# EAGLE design Un_TTL_2 (EAGLE 7.5.0)
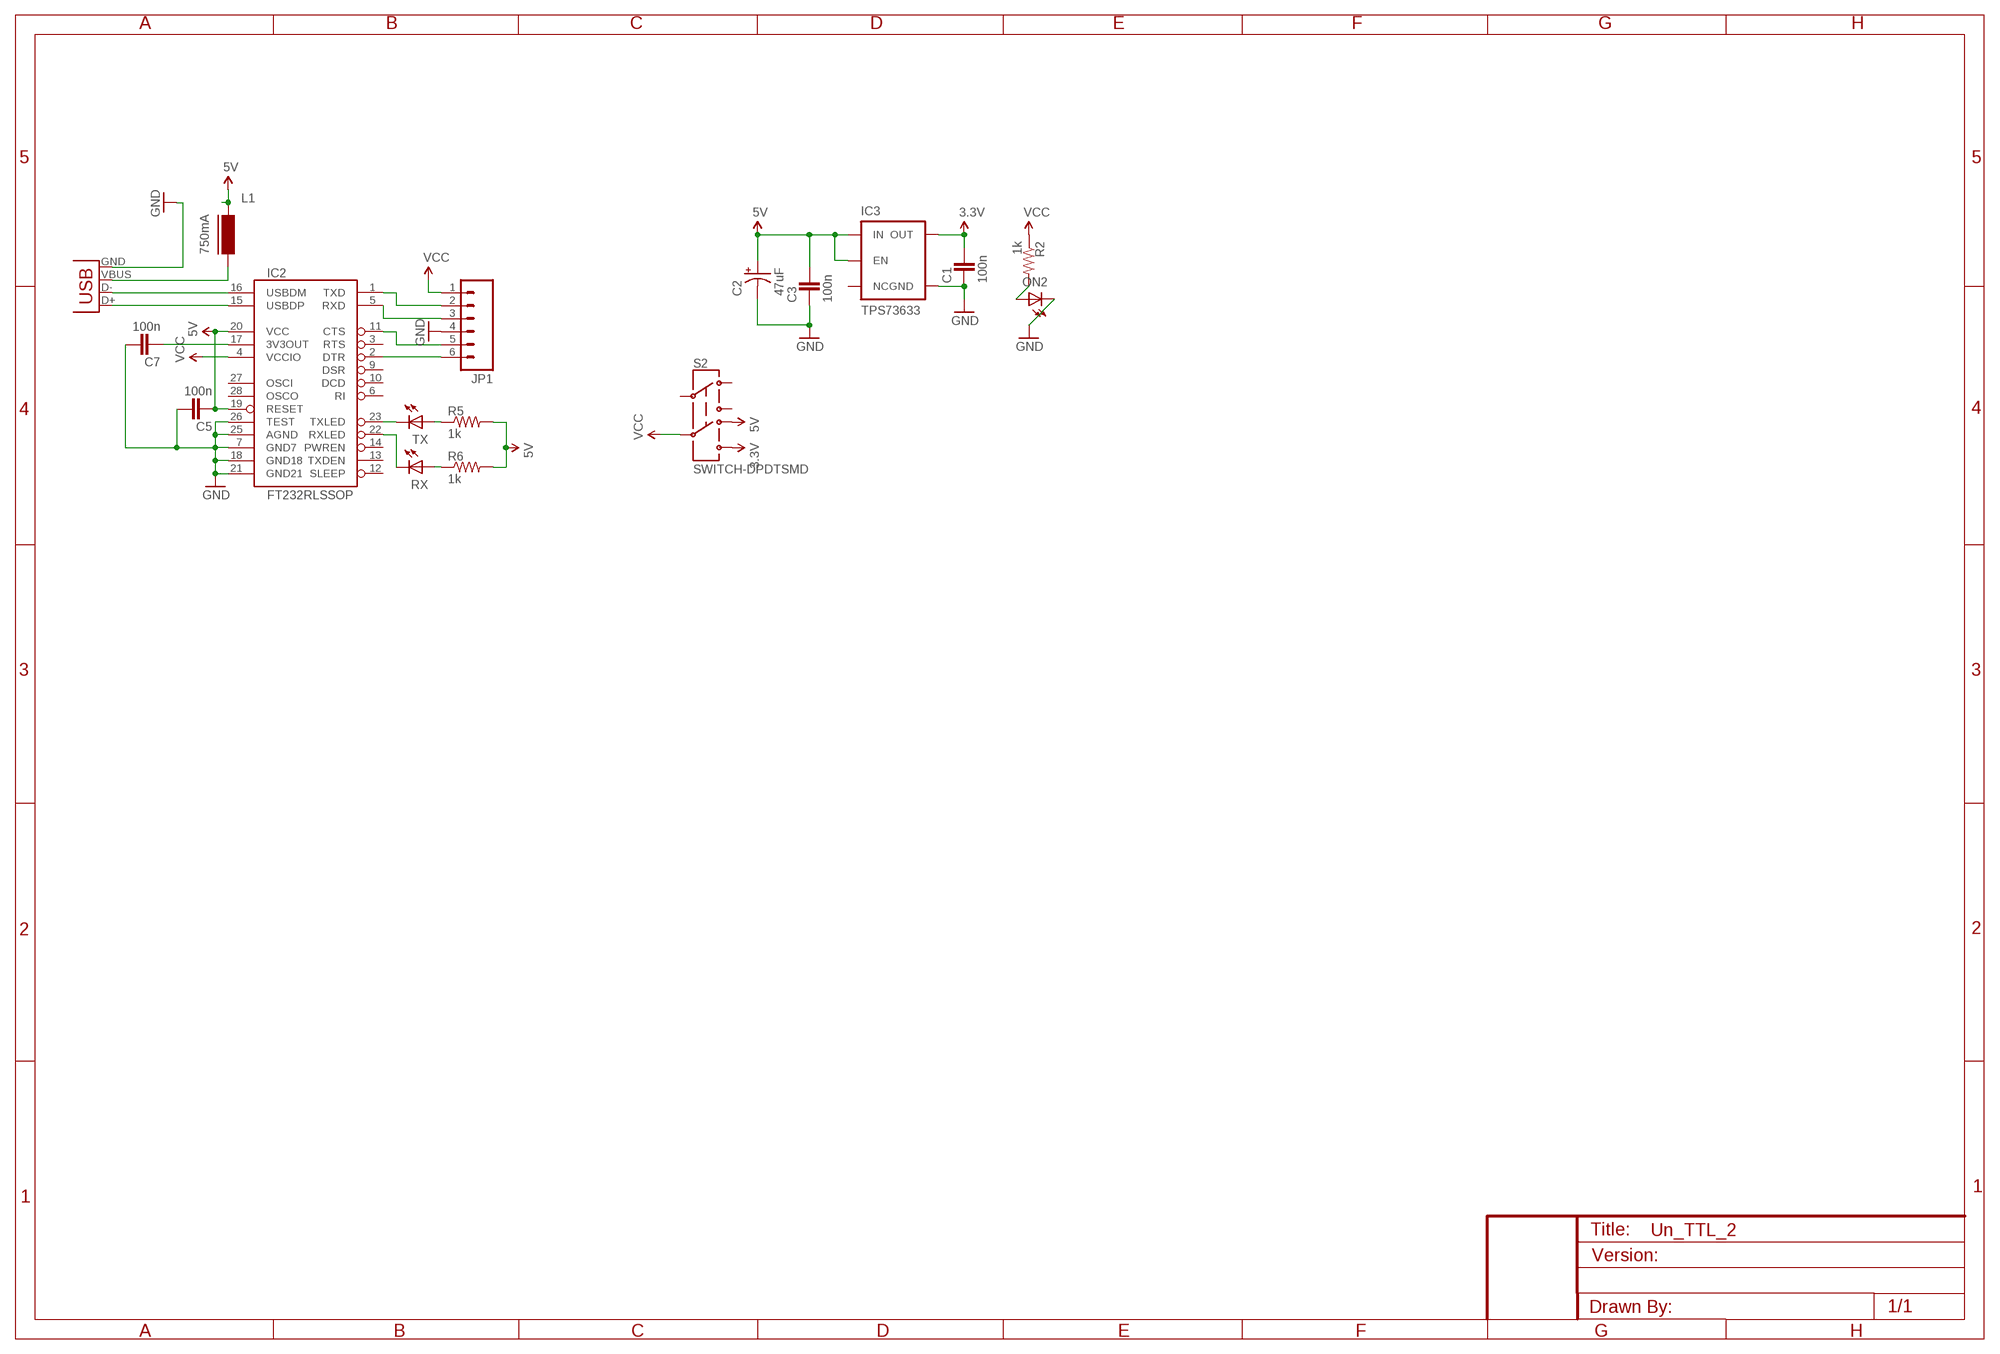
[diagram p0: schematic, sheet 1]

## Parts
C1  100n  CAP0603  [0603-CAP]
C2  47uF  CAP_POL1206  [EIA3216]
C3  100n  CAP0603  [0603-CAP]
C5  100n  CAP0603  [0603-CAP]
C7  100n  CAP0603  [0603-CAP]
IC2  FT232RLSSOP  [SSOP28DB]
IC3  TPS73633  V_REG_TPS76433SOT23-5  [SOT23-5]
JP1  M06SIP  [1X06]
L1  750mA  FERRITE-0805  [FB805]
ON2  LED0603  [LED-0603]
R2  1k  RESISTOR0603-RES  [0603-RES]
R5  1k  RESISTOR0603-RES  [0603-RES]
R6  1k  RESISTOR0603-RES  [0603-RES]
RX  LED0603  [LED-0603]
S2  SWITCH-DPDTSMD  [AYZ0202]
TX  LED0603  [LED-0603]
X2  USB_4-A-H  [USB-A-H]

## Nets
3.3V: C1.1 IC3.5(OUT) S2.6
5V [usbvcc]: C2.A(+) C3.1 C5.2 IC2.19(RESET) IC2.20(VCC) IC3.1(IN) IC3.3(EN) L1.1 R5.2 R6.2 S2.4
DTR: IC2.11(CTS) JP1.5
GND [gnd]: C1.2 C2.C(-) C3.2 C5.1 C7.1 IC2.7(GND7) IC2.18(GND18) IC2.21(GND21) IC2.25(AGND) IC2.26(TEST) IC3.2(GND) JP1.4 ON2.C X2.GND
N$1: L1.2 X2.VBUS
N$2: ON2.A R2.2
N$3: R5.1 TX.A
N$4: IC2.2(DTR) JP1.6
N$5: IC2.16(USBDM) X2.D-
N$6: IC2.15(USBDP) X2.D+
N$7: IC2.23(TXLED) TX.C
N$8: R6.1 RX.A
N$10: IC2.22(RXLED) RX.C
N$22: C7.2 IC2.17(3V3OUT)
RXD: IC2.5(RXD) JP1.3
TXD: IC2.1(TXD) JP1.2
VCC: IC2.4(VCCIO) JP1.1 R2.1 S2.5
Unconnected: IC2.3(RTS) IC2.6(RI) IC2.9(DSR) IC2.10(DCD) IC2.12(SLEEP) IC2.13(TXDEN) IC2.14(PWREN) IC2.27(OSCI) IC2.28(OSCO) IC3.4(NC) S2.1 S2.2 S2.3

## Library data of the parts
C1 C3 C5 C7 = 2SparkFun:CAP: Capacitor Standard 0603 ceramic capacitor, and 0.1" leaded capacitor.
C2 = 2SparkFun:CAP_POL: Capacitor Polarized These are standard SMD and PTH capacitors. Normally 10uF, 47uF, and 100uF in electrolytic and tantalum varieties. Always verify the external diameter of the through hole cap, it varies with capacity, voltage, and manufacturer. The EIA devices should be standard.
IC2 = 1SparkFun:FT232RL: USB UART FT232RL 4th Generation USB UART (USB <-> Serial) Controller. Spark Fun Electronics SKU : COM-00650
IC3 = 2SparkFun:V_REG_TPS76433: Voltage Regulator Older TI part. LDO 150mA regulator. No output by-pass cap option. See V_REG_LDO for a better part.
JP1 = 2SparkFun:M06: Header 6 Standard 6-pin 0.1" header. Use with straight break away headers (SKU : PRT-00116), right angle break away headers (PRT-00553), swiss pins (PRT-00743), machine pins (PRT-00117), and female headers (PRT-00115). Molex polarized connector foot print use with SKU : PRT-08094 with associated crimp pins and housings. NOTES ON THE VARIANTS LOCK and LOCK_LONGPADS... This footprint was designed to help hold the alignment of a through-hole component (i.e. 6-pin header) while soldering it into place. You may notice that each hole has been shifted either up or down by 0.005 of an inch from it's more standard position (which is a perfectly straight line). This slight alteration caused the pins (the squares in the middle) to touch the edges of the holes. Because they are alternating, it causes a "brace" to hold the component in place. 0.005 has proven to be the perfect amount of "off-center" position when using our standard breakaway headers. Although looks a little odd when you look at the bare footprint, once you have a header in there, the alteration is very hard to notice. Also, if you push a header all the way into place, it is covered up entirely on the bottom side. This idea of altering the position of holes to aid alignment will be further integrated into the Sparkfun Library for other footprints. It can help hold any component with 3 or more connection pins.
L1 = 2SparkFun:FERRITE: Ferrite bead in various packages
ON2 RX TX = 2SparkFun:LED: LEDs Standard schematic elements and footprints for 5mm, 3mm, 1206, and 0603 sized LEDs. 5mm - Spark Fun Electronics SKU : COM-00529 (and others)
R2 R5 R6 = 2SparkFun:RESISTOR: Resistor Basic schematic elements and footprints for 0603, 1206, and PTH resistors.
S2 = 2SparkFun:SWITCH-DPDT: DPDT Version of the COM-00597
X2 = 2SparkFun:USB_4: USB Connectors USB-B-PTH is fully proven SKU : PRT-00139 USB-miniB is fully proven SKU : PRT-00587 USB-A-PCB is untested. USB-A-H is throughly reviewed, but untested. Spark Fun Electronics SKU : PRT-00437 USB-B-SMT is throughly reviewed, but untested. Needs silkscreen touching up. USB-A-S has not been used/tested USB-MB-H has not been used/tested

## Net classes
0 default: width 0.254 mm, clearance 0.254 mm
1 power: width 0.61 mm, drill 0.61 mm, clearance 0.254 mm
2 gnd: width 0.305 mm, drill 0.381 mm, clearance 0.254 mm
3 usbvcc: width 0.508 mm, drill 0.61 mm, clearance 0.254 mm
4 aref: width 0.406 mm, drill 0.61 mm, clearance 0.254 mm

## Board
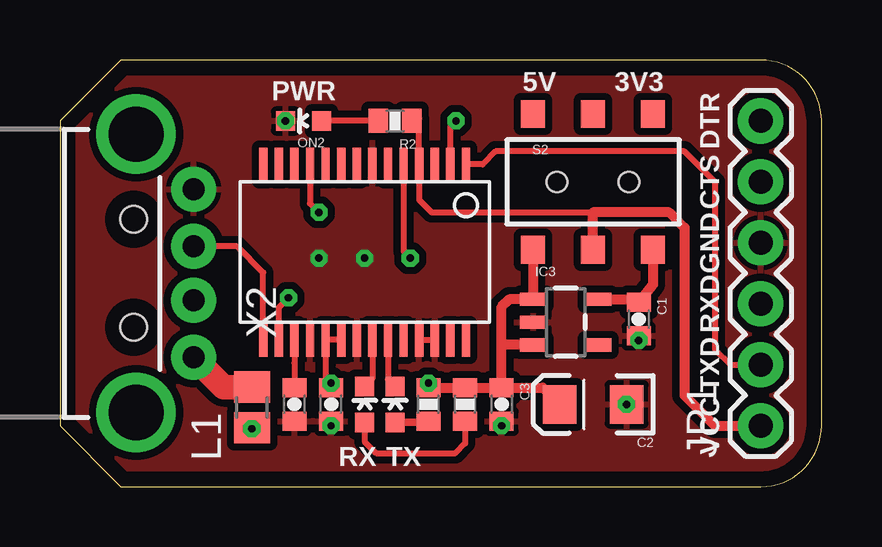
[diagram p1: board, top side]
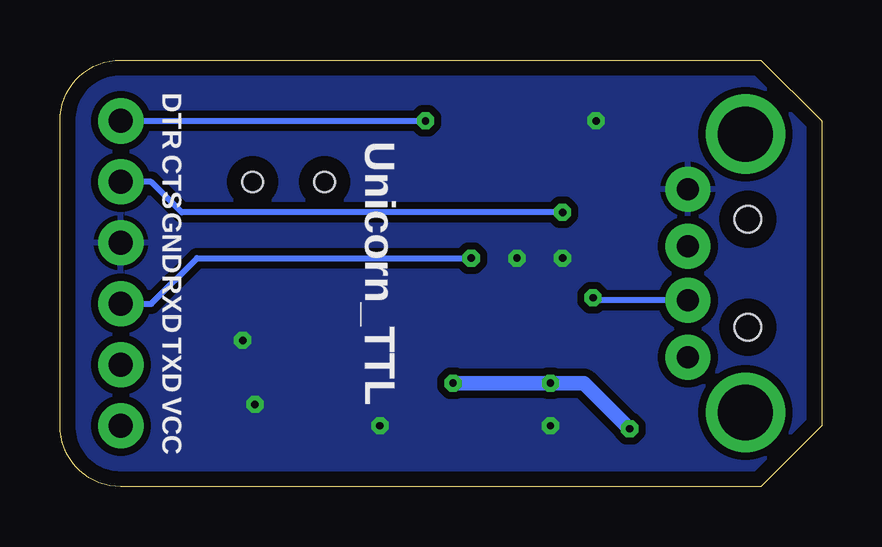
[diagram p2: board, bottom side, seen from below]

Size 31.75 x 17.78 mm. Coordinates in mm from the lower left corner, seen from the top.
Outline: 2.54,0 29.21,0 arc90 31.75,2.54 31.75,15.24 arc90 29.21,17.78 2.54,17.78 0,15.24 0,2.54 2.54,0
Copper layers (1*16): Top 0.035mm / dielectric 1.5mm / Bottom 0.035mm
Design rules "yun": minimum track width 8mil, minimum drill 15mil, track to track 8mil, track to pad 8mil, pad to pad 8mil, via to via 8mil, smd to smd 8mil, copper to edge 25mil, drill to drill 8mil, minimum pad ring 10mil, minimum via ring 8mil, stop-mask expansion 4mil, vias tented up to drill 20mil, thermal gap 8mil

### Footprints (pad centres in the part's own frame; a part is rotated, then mirrored left to right if it is on the bottom)
0603-CAP = smd 0.8 x 1: 1 -0.7,0; 2 0.7,0
EIA3216 = smd 1.4 x 1.6: A 1.4,0; C -1.4,0
SSOP28DB = smd 0.348 x 1.397: 1 -4.225,-3.656; 2 -3.575,-3.656; 3 -2.925,-3.656; 4 -2.275,-3.656; 5 -1.625,-3.656; 6 -0.975,-3.656; 7 -0.325,-3.656; 8 0.325,-3.656; 9 0.975,-3.656; 10 1.625,-3.656; 11 2.275,-3.656; 12 2.925,-3.656; 13 3.575,-3.656; 14 4.225,-3.656; 15 4.225,3.656; 16 3.575,3.656; 17 2.925,3.656; 18 2.275,3.656; 19 1.625,3.656; 20 0.975,3.656; 21 0.325,3.656; 22 -0.325,3.656; 23 -0.975,3.656; 24 -1.625,3.656; 25 -2.275,3.656; 26 -2.925,3.656; 27 -3.575,3.656; 28 -4.225,3.656
SOT23-5 = smd 1.1 x 0.55: 1 -1.35,0.95; 2 -1.35,0; 3 -1.35,-0.95; 4 1.35,-0.95; 5 1.35,0.95
1X06 = drill 1 pad 1.88: 1 0,0; 2 2.54,0; 3 5.08,0; 4 7.62,0; 5 10.16,0; 6 12.7,0
FB805 = smd 1.3 x 1.5: 1 -0.85,0; 2 0.85,0
LED-0603 = smd 0.8 x 0.8: A 0,-0.75; C 0,0.75
0603-RES = smd 0.8 x 1: 1 -0.7,0; 2 0.7,0
AYZ0202 = smd 1 x 1.15: 1 -2.5,2.825; 2 0,2.825; 3 2.5,2.825; 4 -2.5,-2.825; 5 0,-2.825; 6 2.5,-2.825 | hole 0.85: 1.5,0; -1.5,0
USB-A-H = drill 0.914 pad 1.88: D+ 2.4,1.127; D- 2.4,-1.127; GND 2.4,3.5; VBUS 2.4,-3.5 | drill 2.3: GND2 0,-5.8; GND3 0,5.8 | hole 1.1: -0.1,2.25; -0.1,-2.25

### Placement (x,y rotation side)
C1  24.13,6.98 270 top
C2  22.22,3.43 180 top
C3  18.41,3.43 270 top
C5  11.3,3.43 90 top
C7  9.78,3.43 90 top
IC2  12.7,9.78 180 top
IC3  21.08,6.86 0 top
JP1  29.21,2.54 90 top
L1  8,3.3 90 top
ON2  10.16,15.24 90 top
R2  13.97,15.24 180 top
R5  15.37,3.43 90 top
R6  16.89,3.43 90 top
RX  12.7,3.43 0 top
S2  22.22,12.7 0 top
TX  13.97,3.43 0 top
X2  3.17,8.89 0 top

### Tracks (layer width: path | path; a pad name or v marks a point on that pad's centre or on a via)
3.3V
  Top 0.406: S2.6 24.72,8.43 C1.1 24.01,7.81 IC3.5
5V  (via drill 0.3)
  Top 0.254: C5.2 11.08,4.56 IC2.19 IC2.20
  Top 0.406: R5.2 R6.2 C3.1 | S2.4 IC3.1 18.73,7.81 18.41,7.49 18.41,5.91 | C3.1 18.41,5.91 | IC3.3 18.41,5.91 | C3.1 20.12,4.13 C2.A
  Top 0.61: C5.2 v11.3,4.32 | v15.37,4.32 R5.2 | L1.1 v8,2.41
  Bottom 0.61: v15.37,4.32 v11.3,4.32 9.91,4.32 v8,2.41
DTR  (via drill 0.3)
  Top 0.254: IC2.11 10.42,11.8 v10.8,11.43
  Bottom 0.254: v10.8,11.43 26.67,11.43 27.94,12.7 JP1.5
GND  (via drill 0.3)
  Top 0.254: IC2.25 IC2.26
  other vias: 12.7,9.52 10.8,9.52 23.62,3.43 24.13,6.1 9.4,15.24 11.3,2.54 18.41,2.54
  pour Bottom (isolate 0.305, rank 2): 0,0 31.75,0 31.75,17.78 0,17.78
  pour Top (isolate 0.305, rank 2): 0,0 31.75,0 31.75,17.78 0,17.78
N$1
  Top 1.016: X2.VBUS 6.81,4.15 L1.2
N$2
  Top 0.254: R2.2 ON2.A
N$3
  Top 0.305: TX.A 15.14,2.68 R5.1
N$4  (via drill 0.3)
  Top 0.254: IC2.2 16.27,15 v16.51,15.24
  Bottom 0.254: JP1.6 v16.51,15.24
N$5  (via drill 0.3)
  Top 0.254: IC2.16 9.12,7.47 v9.52,7.87
  Bottom 0.254: X2.D- 9.41,7.76 v9.52,7.87
N$6
  Top 0.254: IC2.15 8.47,8.92 7.38,10.02 X2.D+
N$7
  Top 0.254: IC2.23 13.67,4.47 TX.C
N$8
  Top 0.254: RX.A 12.7,1.88 13.18,1.4 16.48,1.4 16.89,1.8 R6.1
N$10
  Top 0.254: IC2.22 13.02,4.5 RX.C
N$22
  Top 0.254: IC2.17 9.77,5.16 C7.2
RXD  (via drill 0.3)
  Top 0.254: IC2.5 14.33,9.8 v14.61,9.52
  Bottom 0.254: JP1.3 27.94,7.62 26.03,9.52 v14.61,9.52
TXD
  Top 0.254: JP1.2 27.94,5.08 27.3,5.71 27.3,12.7 26.03,13.97 18.16,13.97 17.63,13.43 IC2.1
VCC
  Top 0.254: R2.1 14.97,15.34 IC2.4 14.97,11.95 15.49,11.43 22.22,11.43
  Top 0.406: JP1.1 27.3,2.54 26.03,3.81 26.03,10.79 25.4,11.43 22.22,11.43 S2.5

### Text on the board
tPlace: PWR | 5V | 3V3 | DTR | CTS | GND | RXD | TXD | VCC | RX | TX
bPlace: DTR | CTS | GND | Unicorn_TTL | RXD | TXD | VCC